# EAGLE design StaticPlatformMain_v1 (EAGLE 9.6.2)
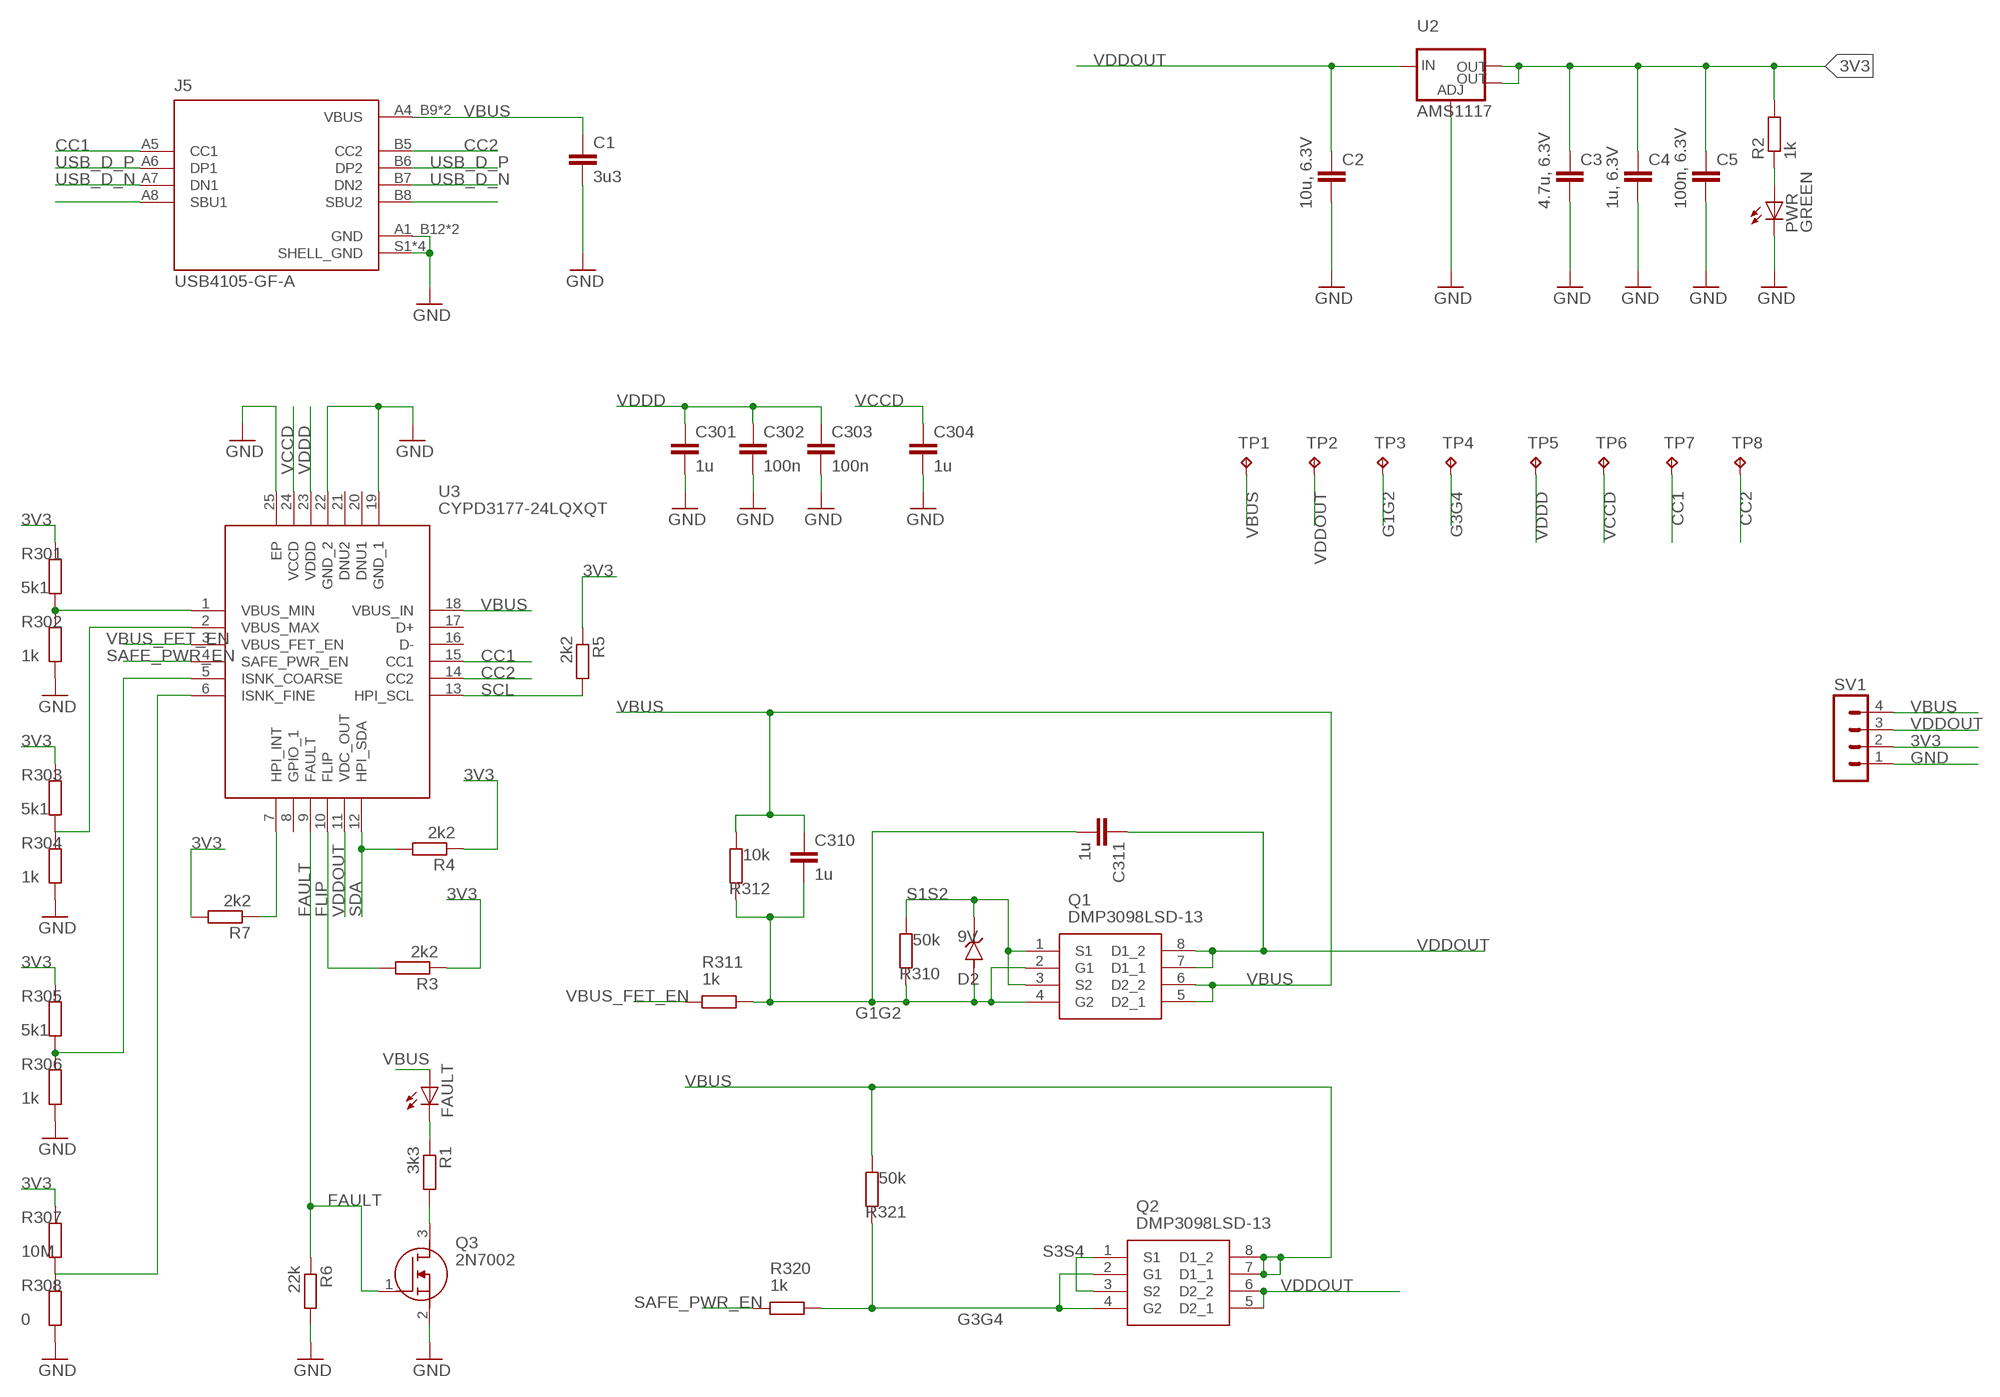
[diagram p0: schematic, sheet 1, part 1 of 2]
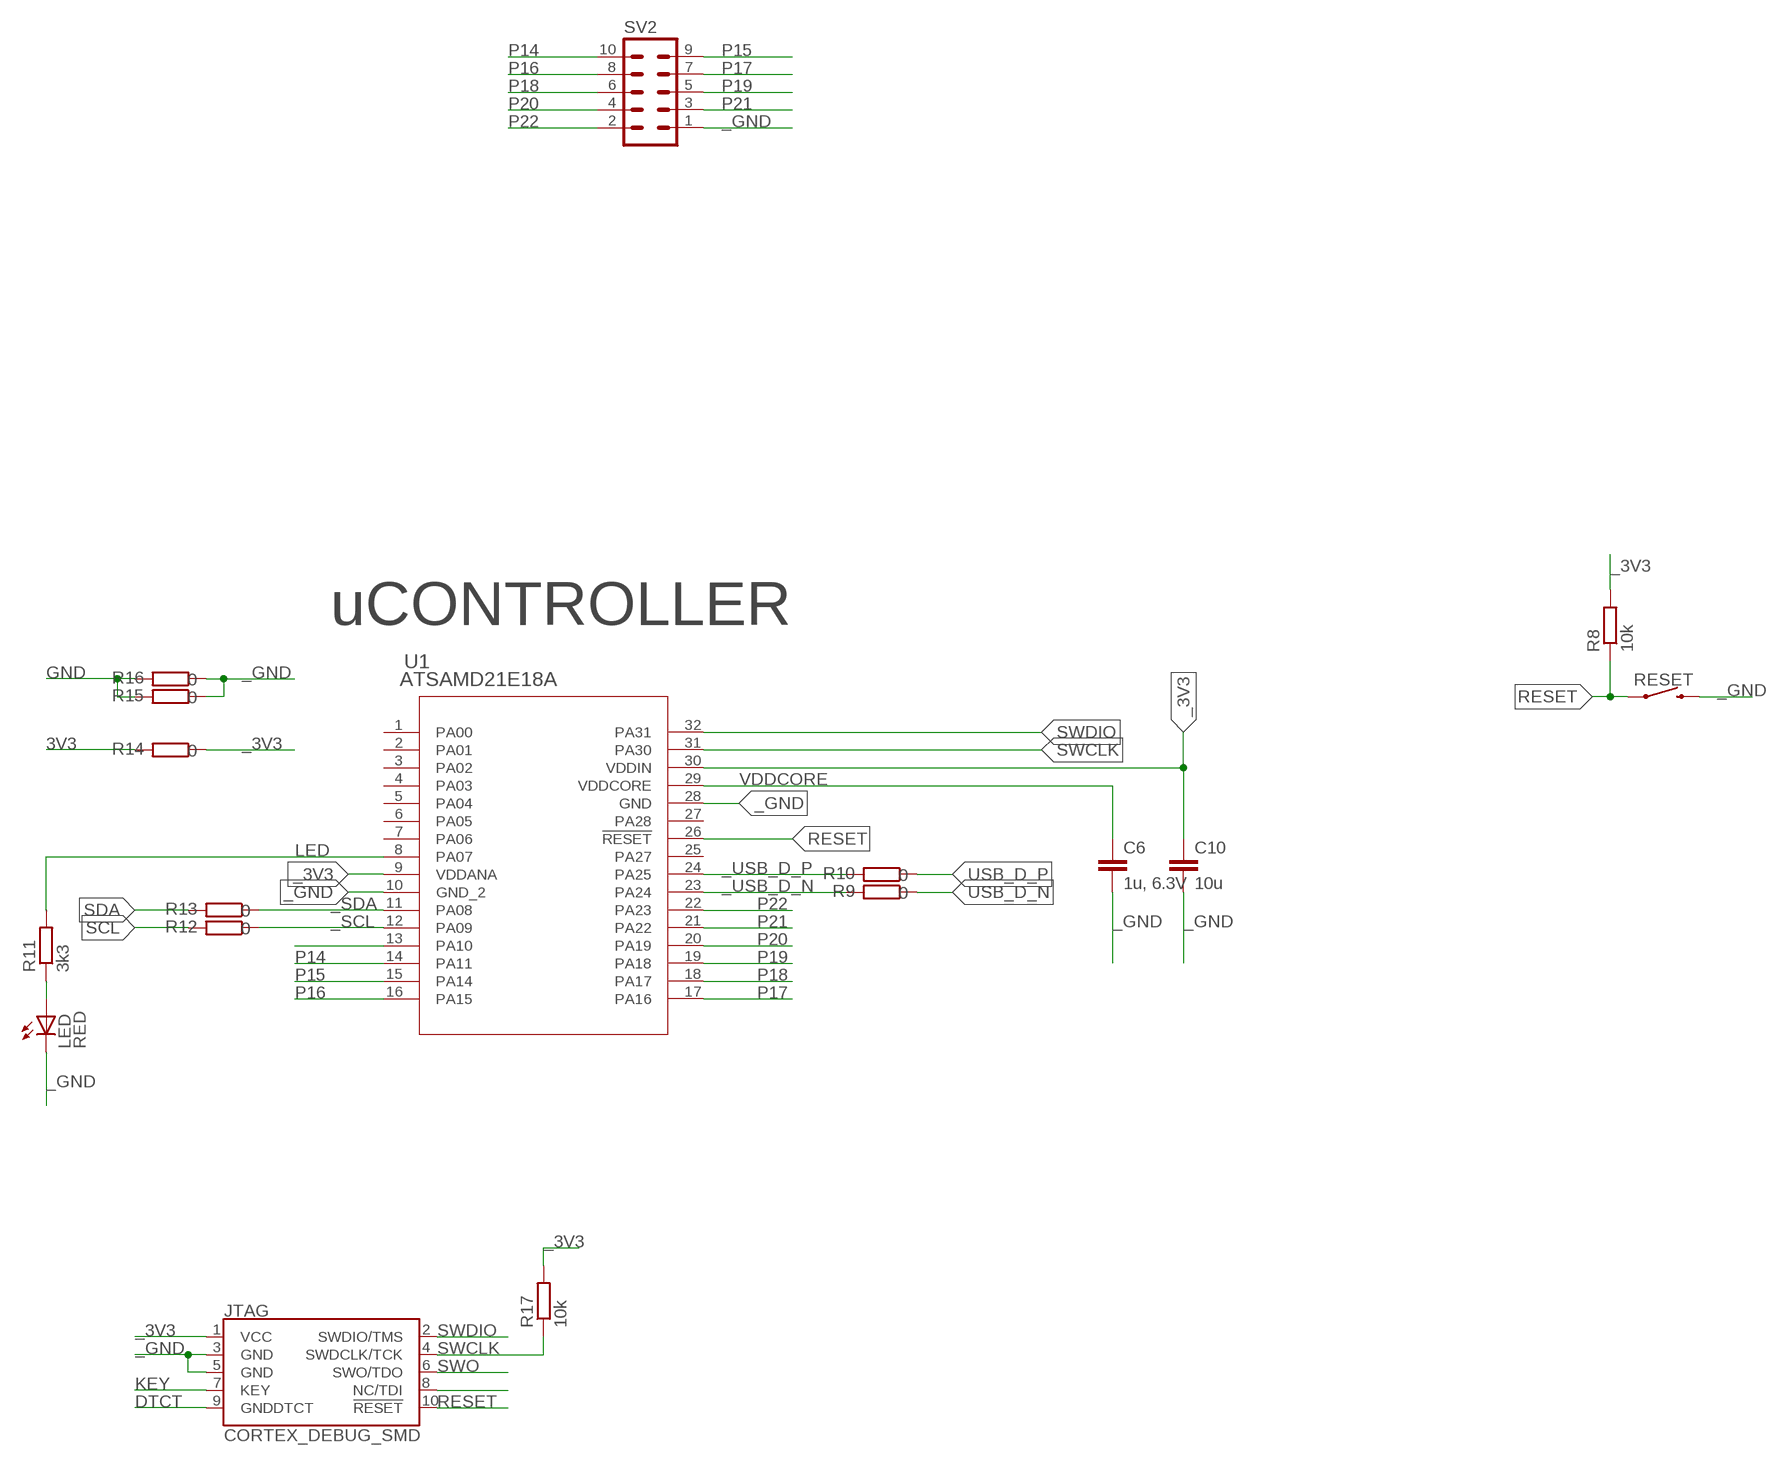
[diagram p1: schematic, sheet 1, part 2 of 2]

## Parts
C1  3u3  C-EUC0805K  [C0805K]
C2  10u, 6.3V  C-EUC0805K  [C0805K]
C3  4.7u, 6.3V  C-EUC0805K  [C0805K]
C4  1u, 6.3V  C-EUC0805K  [C0805K]
C5  100n, 6.3V  C-EUC0805K  [C0805K]
C6  1u, 6.3V  C-EUC0805  [C0805]
C10  10u  C-EUC0805  [C0805]
C301  1u  C-EUC0805K  [C0805K]
C302  100n  C-EUC0805K  [C0805K]
C303  100n  C-EUC0805K  [C0805K]
C304  1u  C-EUC0805K  [C0805K]
C310  1u  C-EUC0805K  [C0805K]
C311  1u  C-EUC0805K  [C0805K]
D2  9V  BZV55C12_L0G  [DIOMELF3515N]
FAULT  GREEN  LEDCHIPLED_0805  [CHIPLED_0805]
J5  USB4105-GF-A  [GCT_USB4105-GF-A]
JTAG  CORTEX_DEBUG_SMD  [SAMTECH_FTSH-105-01]
LED  RED  LEDCHIPLED_0805  [CHIPLED_0805]
PWR  GREEN  LEDCHIPLED_0805  [CHIPLED_0805]
Q1  DMP3098LSD-13  [SOIC127P600X175-8N]
Q2  DMP3098LSD-13  [SOIC127P600X175-8N]
Q3  2N7002  [SOT96P240X120-3N]
R1  3k3  R-EU_R0805  [R0805]
R2  1k  R-EU_R0805  [R0805]
R3  2k2  R-EU_R0805  [R0805]
R4  2k2  R-EU_R0805  [R0805]
R5  2k2  R-EU_R0805  [R0805]
R6  22k  R-EU_R0805  [R0805]
R7  2k2  R-EU_R0805  [R0805]
R8  10k  R-EU_R0805  [R0805]
R9  0  R-EU_R0805  [R0805]
R10  0  R-EU_R0805  [R0805]
R11  3k3  R-EU_R0805  [R0805]
R12  0  R-EU_R0805  [R0805]
R13  0  R-EU_R0805  [R0805]
R14  0  R-EU_R0805  [R0805]
R15  0  R-EU_R0805  [R0805]
R16  0  R-EU_R0805  [R0805]
R17  10k  R-EU_R0805  [R0805]
R301  5k1  R-EU_R0805  [R0805]
R302  1k  R-EU_R0805  [R0805]
R303  5k1  R-EU_R0805  [R0805]
R304  1k  R-EU_R0805  [R0805]
R305  5k1  R-EU_R0805  [R0805]
R306  1k  R-EU_R0805  [R0805]
R307  10M  R-EU_R0805  [R0805]
R308  0  R-EU_R0805  [R0805]
R310  50k  R-EU_R0805  [R0805]
R311  1k  R-EU_R0805  [R0805]
R312  10k  R-EU_R0805  [R0805]
R320  1k  R-EU_R0805  [R0805]
R321  50k  R-EU_R0805  [R0805]
RESET  MOMENTARY-SWITCH-SPST-SMD-6.0X3.5MM  [TACTILE_SWITCH_SMD_6.0X3.5MM]
SV1  MA04-1  [MA04-1]
SV2  MA05-2  [MA05-2]
TP1  TPTP18R  [TP18R]
TP2  TPTP18R  [TP18R]
TP3  TPTP18R  [TP18R]
TP4  TPTP18R  [TP18R]
TP5  TPTP18R  [TP18R]
TP6  TPTP18R  [TP18R]
TP7  TPTP18R  [TP18R]
TP8  TPTP18R  [TP18R]
U1  ATSAMD21E18A  ATSAMD21E18A-AUTQFP32_MC_MCH-M  [TQFP32_MC_MCH-M]
U2  AMS1117  V_REG_LM1117SOT223  [SOT223]
U3  CYPD3177-24LQXQT  [QFN50P400X400X60-25N]

## Nets
3V3: C3.1 C4.1 C5.1 R2.2 R3.1 R4.1 R5.1 R7.2 R14.2 R301.2 R303.2 R305.2 R307.2 SV1.2 U2.2(OUT) U2.4(OUT)
_3V3: C10.1 JTAG.1(VCC) R8.2 R14.1 R17.2 U1.9(VDDANA) U1.30(VDDIN)
_GND: C6.2 C10.2 JTAG.3(GND) JTAG.5(GND) LED.C R15.1 R16.1 RESET.2 SV2.1 U1.10(GND_2) U1.28(GND)
_SCL: R12.1 U1.12(PA09)
_SDA: R13.1 U1.11(PA08)
_USB_D_N [usbpair]: R9.2 U1.23(PA24)
_USB_D_P [usbpair]: R10.2 U1.24(PA25)
CC1: J5.A5(CC1) TP7.TP U3.15(CC1)
CC2: J5.B5(CC2) TP8.TP U3.14(CC2)
DTCT: JTAG.9(GNDDTCT)
FAULT: Q3.1(G) R6.1 U3.9(FAULT)
FLIP: R3.2 U3.10(FLIP)
G1G2: C310.2 C311.2 D2.A Q1.2(G1) Q1.4(G2) R310.2 R311.1 R312.2 TP3.TP
G3G4: Q2.2(G1) Q2.4(G2) R320.1 R321.2 TP4.TP
GND: C1.2 C2.2 C3.2 C4.2 C5.2 C301.2 C302.2 C303.2 C304.2 J5.A1_B12(GND) J5.B1_A12(GND) J5.S1(SHELL_GND) J5.S2(SHELL_GND) J5.S3(SHELL_GND) J5.S4(SHELL_GND) PWR.C Q3.2(S) R6.2 R15.2 R16.2 R302.1 R304.1 R306.1 R308.1 SV1.1 U2.1(ADJ) U3.19(GND_1) U3.22(GND_2) U3.25(EP)
KEY: JTAG.7(KEY)
LED: R11.2 U1.8(PA07)
LED_GP: LED.A R11.1
LED_PWR: PWR.A R2.1
N$1: FAULT.C R1.1
N$2: R7.1 U3.7(HPI_INT)
N$3: R301.1 R302.2 U3.1(VBUS_MIN)
N$4: R303.1 R304.2 U3.2(VBUS_MAX)
N$5: R305.1 R306.2 U3.5(ISNK_COARSE)
N$7: Q3.3(D) R1.2
N$9: J5.A8(SBU1)
N$10: R307.1 R308.2 U3.6(ISNK_FINE)
N$19: J5.B8(SBU2)
N$24: JTAG.8(NC/TDI)
N$28: U1.13(PA10)
P14: SV2.10 U1.14(PA11)
P15: SV2.9 U1.15(PA14)
P16: SV2.8 U1.16(PA15)
P17: SV2.7 U1.17(PA16)
P18: SV2.6 U1.18(PA17)
P19: SV2.5 U1.19(PA18)
P20: SV2.4 U1.20(PA19)
P21: SV2.3 U1.21(PA22)
P22: SV2.2 U1.22(PA23)
RESET: JTAG.10(!RESET) R8.1 RESET.1 U1.26(!RESET)
S1S2: D2.C(K) Q1.1(S1) Q1.3(S2) R310.1
S3S4: Q2.1(S1) Q2.3(S2)
SAFE_PWR_EN: R320.2 U3.4(SAFE_PWR_EN)
SCL: R5.2 R12.2 U3.13(HPI_SCL)
SDA: R4.2 R13.2 U3.12(HPI_SDA)
SWCLK: JTAG.4(SWDCLK/TCK) R17.1 U1.31(PA30)
SWDIO: JTAG.2(SWDIO/TMS) U1.32(PA31)
SWO: JTAG.6(SWO/TDO)
USB_D_N [usbpair]: J5.A7(DN1) J5.B7(DN2) R9.1
USB_D_P [usbpair]: J5.A6(DP1) J5.B6(DP2) R10.1
VBUS: C1.1 C310.1 FAULT.A J5.A4_B9(VBUS) J5.B4_A9(VBUS) Q1.5(D2_1) Q1.6(D2_2) Q2.7(D1_1) Q2.8(D1_2) R312.1 R321.1 SV1.4 TP1.TP U3.18(VBUS_IN)
VBUS_FET_EN: R311.2 U3.3(VBUS_FET_EN)
VCCD: C304.1 TP6.TP U3.24(VCCD)
VDDCORE: C6.1 U1.29(VDDCORE)
VDDD: C301.1 C302.1 C303.1 TP5.TP U3.23(VDDD)
VDDOUT: C2.1 C311.1 Q1.7(D1_1) Q1.8(D1_2) Q2.5(D2_1) Q2.6(D2_2) SV1.3 TP2.TP U2.3(IN) U3.11(VDC_OUT)
Unconnected: U1.1(PA00) U1.2(PA01) U1.3(PA02) U1.4(PA03) U1.5(PA04) U1.6(PA05) U1.7(PA06) U1.25(PA27) U1.27(PA28) U3.8(GPIO_1) U3.16(D-) U3.17(D+) U3.20(DNU1) U3.21(DNU2)

## Notes on the sheet
- uCONTROLLER

## Library data of the parts
C1-C6 C10 C301-C304 C310 C311 = rcl:C-EU: CAPACITOR, European symbol; SPICEPREFIX: C
D2 = BZV55C12_L0G:BZV55C12_L0G: Check availability <https://pricing.snapeda.com/parts/BZV55C12%20L0G/Taiwan%20Semiconductor%20Corporation/view-part?ref=eda>; AVAILABILITY: In Stock; CHECK_PRICES: https://www.snapeda.com/parts/BZV55C12%20L0G/Taiwan+Semiconductor/view-part/?ref=eda; DESCRIPTION: MMELF, 500mW, 5%, Small Signal Zener Diode; MF: Taiwan Semiconductor Corporation; MP: BZV55C12 L0G; PACKAGE: MINI MELF-2-2 Taiwan Semiconductor; PRICE: None; PURCHASE-URL: https://www.snapeda.com/api/url_track_click_mouser/?unipart_id=6304637&manufacturer=Taiwan Semiconductor Corporation&part_name=BZV55C12 L0G&search_term=None; SNAPEDA_LINK: https://www.snapeda.com/parts/BZV55C12%20L0G/Taiwan+Semiconductor/view-part/?ref=snap
FAULT LED PWR = adafruit:LED: LED OSRAM: - CHIPLED LG R971, LG N971, LY N971, LG Q971, LY Q971, LO R971, LY R971 LH N974, LH R974 LS Q976, LO Q976, LY Q976 LO Q996 - Hyper CHIPLED LW Q18S LB Q993, LB Q99A, LB R99A - SideLED LS A670, LO A670, LY A670, LG A670, LP A670 LB A673, LV A673, LT A673, LW A673 LH A674 LY A675 LS A676, LA A676, LO A676, LY A676, LW A676 LS A679, LY A679, LG A679 - Hyper Micro SIDELED® LS Y876, LA Y876, LO Y876, LY Y876 LT Y87S - SmartLED LW L88C, LW L88S LB L89C, LB L89S, LG L890 LS L89K, LO L89K, LY L89K LS L896, LA L896, LO L896, LY L896 - TOPLED LS T670, LO T670, LY T670, LG T670, LP T670 LSG T670, LSP T670, LSY T670, LOP T670, LYG T670 LG T671, LOG T671, LSG T671 LB T673, LV T673, LT T673, LW T673 LH T674 LS T676, LA T676, LO T676, LY T676, LB T676, LH T676, LSB T676, LW T676 LB T67C, LV T67C, LT T67C, LS T67K, LO T67K, LY T67K, LW E67C LS E67B, LA E67B, LO E67B, LY E67B, LB E67C, LV E67C, LT E67C LW T67C LS T679, LY T679, LG T679 LS T770, LO T770, LY T770, LG T770, LP T770 LB T773, LV T773, LT T773, LW T773 LH T774 LS E675, LA E675, LY E675, LS T675 LS T776, LA T776, LO T776, LY T776, LB T776 LHGB T686 LT T68C, LB T68C - Hyper Mini TOPLED® LB M676 - Mini TOPLED Santana® LG M470 LS M47K, LO M47K, LY M47K Source: http://www.osram.convergy.de/
J5 = USB4105-GF-A:USB4105-GF-A: USB-C (USB TYPE-C) USB 2.0 Receptacle Connector 24 (16+8 Dummy) Position Surface Mount, Right Angle; Through Hole Check availability <https://pricing.snapeda.com/parts/USB4105-GF-A/GCT/view-part?ref=eda>; AVAILABILITY: In Stock; DESCRIPTION: USB-C (USB TYPE-C) USB 2.0 Receptacle Connector 24 (16+8 Dummy) Position Surface Mount, Right Angle; Through Hole; MF: GCT; MP: USB4105-GF-A; PACKAGE: None; PRICE: None; PURCHASE-URL: https://pricing.snapeda.com/search?q=USB4105-GF-A&ref=eda
JTAG = SparkFun-Connectors:CORTEX_DEBUG: Cortex Debug Connector - 10 pin Supports JTAG debug, Serial Wire debug, and Serial Wire Viewer. PTH and SMD connector options available. General Connector Information <http://infocenter.arm.com/help/topic/com.arm.doc.faqs/attached/13634/cortex_debug_connectors.pdf> Products: PTH Connector <http://www.digikey.com/product-detail/en/cnc-tech/3220-10-0100-00/1175-1627-ND/3883661> -via Digi-Key SparkFun PSoc <https://www.sparkfun.com/products/13229> SparkFun T <https://www.sparkfun.com/products/13810>
Q1 Q2 = DMP3098LSD-13:DMP3098LSD-13: MOSFET PMOS-DUAL Source: Datasheet <https://www.diodes.com/assets/Datasheets/ds31448.pdf>; DESCRIPTION: MOSFET PMOS-DUAL; HEIGHT: 1.75mm; MANUFACTURER_NAME: Diodes Inc.; MANUFACTURER_PART_NUMBER: DMP3098LSD-13; MOUSER_PART_NUMBER: 621-DMP3098LSD-13; MOUSER_PRICE-STOCK: https://www.mouser.co.uk/ProductDetail/Diodes-Incorporated/DMP3098LSD-13?qs=oUsD4qhOtFxafARAi3NzqQ%3D%3D
Q3 = 2N7002:2N7002: N-channel MOSFET,2N7002 0.115A 60V Source: Datasheet <https://www.onsemi.com/pub/Collateral/NDS7002A-D.PDF>; DESCRIPTION: N-channel MOSFET,2N7002 0.115A 60V; HEIGHT: 1.2mm; MANUFACTURER_NAME: onsemi; MANUFACTURER_PART_NUMBER: 2N7002; MOUSER_PART_NUMBER: 512-2N7002; MOUSER_PRICE-STOCK: https://www.mouser.co.uk/ProductDetail/onsemi-Fairchild/2N7002?qs=0dwsXDNhqlz66WJJhrTFjQ%3D%3D
R1-R17 R301-R308 R310-R312 R320 R321 = rcl:R-EU_: RESISTOR, European symbol; SPICEPREFIX: R
RESET = SparkFun-Switches:MOMENTARY-SWITCH-SPST: Momentary Switch (Pushbutton) - SPST Normally-open (NO) SPST momentary switches (buttons, pushbuttons). Variants PTH-12MM - 12mm square, through-hole Momentary Pushbutton Switch - 12mm Square <https://www.sparkfun.com/products/9190> (COM-09190) PTH-6.0MM, PTH-6.0MM-KIT - 6.0mm square, through-hole Mini Pushbutton Switch <https://www.sparkfun.com/products/97> (COM-00097) KIT package intended for soldering kit's - only one side of pads' copper is exposed. PTH-RIGHT-ANGLE-KIT - Right-angle, through-hole Right Angle Tactile Button <https://www.sparkfun.com/products/10791> - Used on SparkFun BigTime Watch Kit <https://www.sparkfun.com/products/11734> SMD-12MM - 12mm square, surface-mount Tactile Button - SMD (12mm) <https://www.sparkfun.com/products/12993> (COM-12993) Used on SparkFun PicoBoard <https://www.sparkfun.com/products/11888> SMD-4.5MM - 4.5mm Square Trackball Switch Used on SparkFun Blackberry Trackballer Breakout <https://www.sparkfun.com/products/13169> SMD-4.6MMX2.8MM - 4.60mm x 2.80mm, surface mount Used on SparkFun Pro Micro - RP2040 <https://www.sparkfun.com/products/17717> SMD-5.2MM, SMD-5.2-REDUNDANT - 5.2mm square, surface-mount Mini Pushbutton Switch - SMD <https://www.sparkfun.com/products/8720> (COM-08720) Used on Arduino Pro Mini <https://www.sparkfun.com/products/11114> REDUNDANT package connects both switch circuits together SMD-6.0X3.5MM - 6.0 x 3.5mm, surface mount Momentary Reset Switch SMD <https://www.sparkfun.com/products/8229> (COM-08229) SMD-6.2MM-TALL - 6.2mm square, surface mount Tactile Button - SMD (6mm) <https://www.sparkfun.com/products/12992> Used on SparkFun Digital Sandbox <https://www.sparkfun.com/products/12651> SMD-RIGHT-ANGLE - Right-angle, surface mount Used on SparkFun Block for Intel® Edison - Arduino <https://www.sparkfun.com/products/13036>; PROD_ID: SWCH-14278; SF_SKU: COM-08229
SV1 = con-lstb_round_pads:MA04-1: PIN HEADER; OC_FARNELL: unknown; OC_NEWARK: unknown
SV2 = con-lstb_round_pads:MA05-2: PIN HEADER; OC_FARNELL: unknown; OC_NEWARK: unknown
TP1-TP8 = testpad:TP: Test pad
U1 = SAMD21E18:ATSAMD21E18A-AU; COPYRIGHT: Copyright (C) 2022 Ultra Librarian. All rights reserved.; MANUFACTURER_PART_NUMBER: ATSAMD21E18A-AU; MFR_NAME: Microchip
U2 = SparkFun-IC-Power:V_REG_LM1117: Voltage Regulator LM1117 Standard adjustable voltage regulator but in SMD form. Spark Fun Electronics SKU : COM-00595; PROD_ID: VREG-08170
U3 = CYPD3177-24LQXQT:CYPD3177-24LQXQT: USB Type-C DFP Port Controller USB 1.1 3.3V/5V T/R 24-Pin QFN EP Source: Datasheet <https://www.cypress.com/file/460416/download>; DESCRIPTION: USB Type-C DFP Port Controller USB 1.1 3.3V/5V T/R 24-Pin QFN EP; HEIGHT: 0.6mm; MANUFACTURER_NAME: Cypress Semiconductor; MANUFACTURER_PART_NUMBER: CYPD3177-24LQXQT; MOUSER_PART_NUMBER: 727-CYPD3177-24LQXQT; MOUSER_PRICE-STOCK: https://www.mouser.co.uk/ProductDetail/Cypress-Semiconductor/CYPD3177-24LQXQT?qs=PzGy0jfpSMvUfBLYWBYBLA%3D%3D

## Net classes
1 usbpair: width 0.25 mm, clearance 0.2 mm

## Board
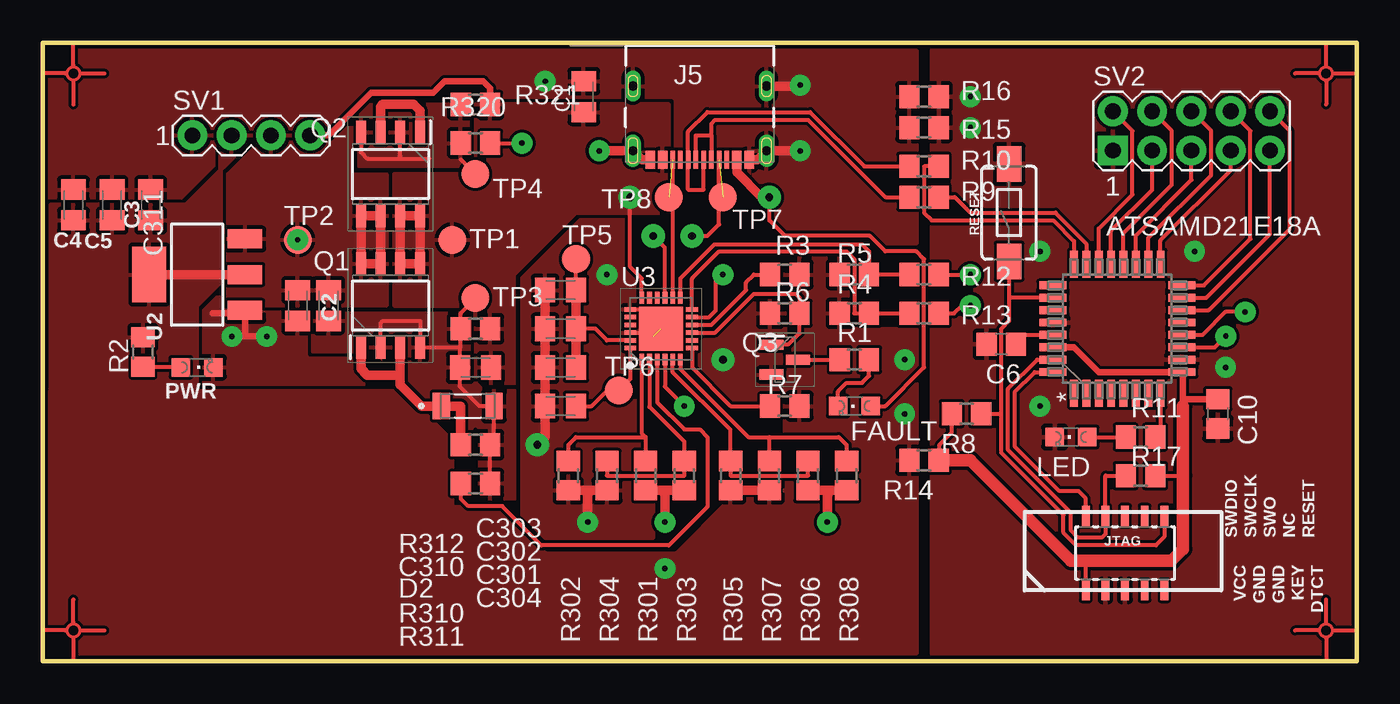
[diagram p2: board, top side]
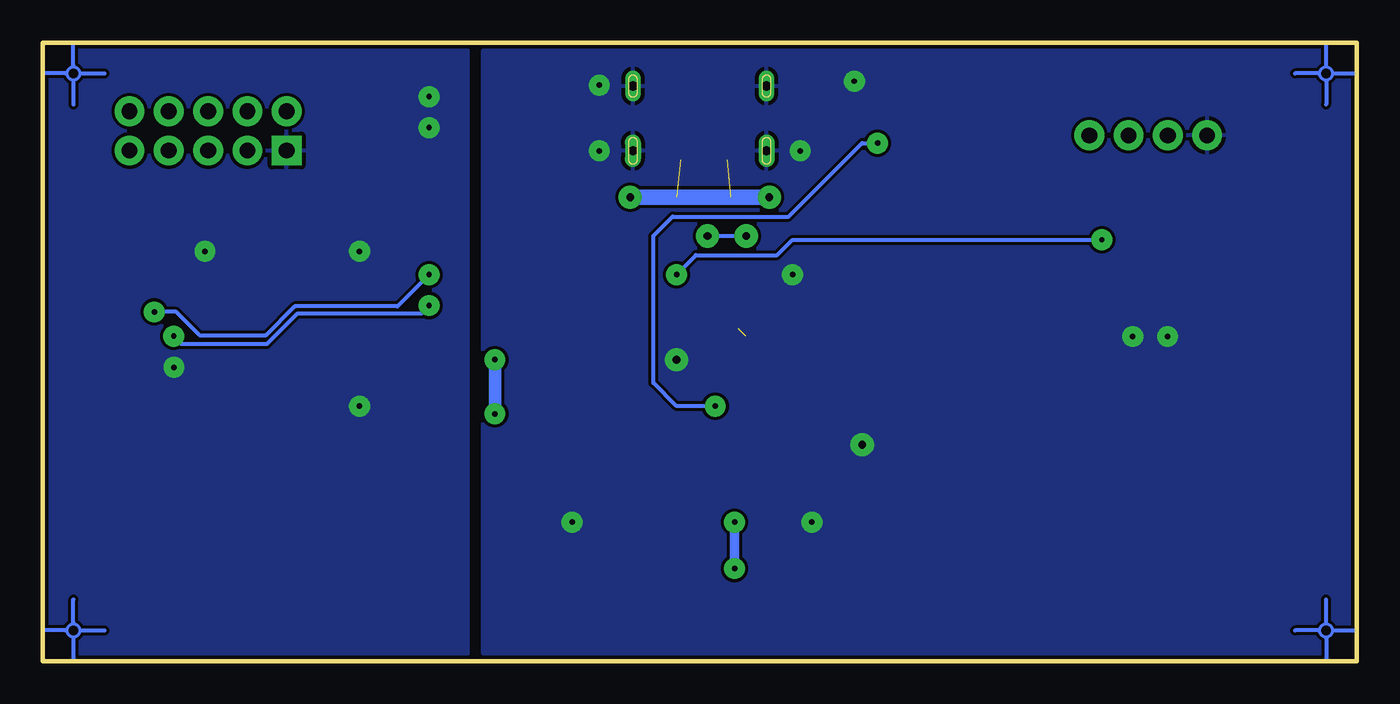
[diagram p3: board, bottom side, seen from below]

Size 85 x 40 mm. Coordinates in mm from the lower left corner, seen from the top.
Outline: 0,40 85,40 85,0 0,0 0,40
Copper layers (1*16): Top 0.035mm / dielectric 1.5mm / Bottom 0.035mm
Design rules "default *": minimum track width 0.25mm, minimum drill 0.35mm, track to track 0.2mm, track to pad 0.2mm, pad to pad 0.2mm, via to via 0.2mm, smd to smd 0.2mm, copper to edge 0.2mm, drill to drill 0.2mm, minimum pad ring 8mil, minimum via ring 0.5mm, stop-mask expansion 4mil, vias tented up to drill 0mil, thermal gap 10mil
tRestrict: 2 lines

### Footprints (pad centres in the part's own frame; a part is rotated, then mirrored left to right if it is on the bottom)
C0805K = smd 1.3 x 1.6: 1 -1,0; 2 1,0
C0805 = smd 1.3 x 1.5: 1 -0.95,0; 2 0.95,0
DIOMELF3515N = smd 1.11 x 1.73: A 1.705,0; C -1.705,0
CHIPLED_0805 = smd 1.2 x 1.2: A 0,-1.05; C 0,1.05
GCT_USB4105-GF-A = smd 0.6 x 1.15: A1_B12 -3.2,4.755; A4_B9 -2.4,4.755; B1_A12 3.2,4.755; B4_A9 2.4,4.755 | smd 0.3 x 1.15: A5 -1.25,4.755; A6 -0.25,4.755; A7 0.25,4.755; A8 1.25,4.755; B5 1.75,4.755; B6 0.75,4.755; B7 -0.75,4.755; B8 -1.75,4.755 | drill 0.6 pad 1.05 long: S1 -4.32,4.18; S4 4.32,4.18 | drill 0.6 pad 1 long: S2 -4.32,0; S3 4.32,0
SAMTECH_FTSH-105-01 = smd 0.508 x 1.27: 1 -2.54,-2.413; 2 -2.54,2.413; 3 -1.27,-2.413; 4 -1.27,2.413; 5 0,-2.413; 6 0,2.413; 7 1.27,-2.413; 8 1.27,2.413; 9 2.54,-2.413; 10 2.54,2.413
SOIC127P600X175-8N = smd 1.5 x 0.65: 1 -2.7,1.905; 2 -2.7,0.635; 3 -2.7,-0.635; 4 -2.7,-1.905; 5 2.7,-1.905; 6 2.7,-0.635; 7 2.7,0.635; 8 2.7,1.905
SOT96P240X120-3N = smd 1.55 x 0.65: 1 -0.85,0.96; 2 -0.85,-0.96; 3 0.85,0
R0805 = smd 1.3 x 1.5: 1 -0.95,0; 2 0.95,0
TACTILE_SWITCH_SMD_6.0X3.5MM = smd 2.3 x 1.6: 1 -3.15,0; 2 3.15,0
MA04-1 = drill 1.016 pad 1.93: 1 -3.81,0; 2 -1.27,0; 3 1.27,0; 4 3.81,0
MA05-2 = drill 1.016 pad 1.93 square: 1 -5.08,-1.27 | drill 1.016 pad 1.93: 2 -5.08,1.27; 3 -2.54,-1.27; 4 -2.54,1.27; 5 0,-1.27; 6 0,1.27; 7 2.54,-1.27; 8 2.54,1.27; 9 5.08,-1.27; 10 5.08,1.27
TP18R = smd 1.8 x 1.8: TP 0,0
TQFP32_MC_MCH-M = smd 1.762 x 0.507: 1 -4.169,2.8; 2 -4.169,2; 3 -4.169,1.2; 4 -4.169,0.4; 5 -4.169,-0.4; 6 -4.169,-1.2; 7 -4.169,-2; 8 -4.169,-2.8; 17 4.169,-2.8; 18 4.169,-2; 19 4.169,-1.2; 20 4.169,-0.4; 21 4.169,0.4; 22 4.169,1.2; 23 4.169,2; 24 4.169,2.8 | smd 0.507 x 1.762: 9 -2.8,-4.169; 10 -2,-4.169; 11 -1.2,-4.169; 12 -0.4,-4.169; 13 0.4,-4.169; 14 1.2,-4.169; 15 2,-4.169; 16 2.8,-4.169; 25 2.8,4.169; 26 2,4.169; 27 1.2,4.169; 28 0.4,4.169; 29 -0.4,4.169; 30 -1.2,4.169; 31 -2,4.169; 32 -2.8,4.169
SOT223 = smd 1.219 x 2.235: 1 -2.311,-3.099; 2 0,-3.099; 3 2.311,-3.099 | smd 3.6 x 2.2: 4 0,3.099
QFN50P400X400X60-25N = smd 0.75 x 0.3: 1 -2,1.25; 2 -2,0.75; 3 -2,0.25; 4 -2,-0.25; 5 -2,-0.75; 6 -2,-1.25; 13 2,-1.25; 14 2,-0.75; 15 2,-0.25; 16 2,0.25; 17 2,0.75; 18 2,1.25 | smd 0.3 x 0.75: 7 -1.25,-2; 8 -0.75,-2; 9 -0.25,-2; 10 0.25,-2; 11 0.75,-2; 12 1.25,-2; 19 1.25,2; 20 0.75,2; 21 0.25,2; 22 -0.25,2; 23 -0.75,2; 24 -1.25,2 | smd 2.85 x 2.85: 25 0,0

### Placement (x,y rotation side)
C1  35,36.5 90 top
C2  16.5,23 270 top
C3  7,29.5 90 top
C4  2,29.5 90 top
C5  4.5,29.5 90 top
C6  62,20.5 180 top
C10  76,16 270 top
C301  33.5,19 180 top
C302  33.5,21.5 180 top
C303  33.5,24 180 top
C304  33.5,16.5 180 top
C310  28,19 180 top
C311  18.5,23 270 top
D2  27.5,16.5 0 top
FAULT  52.5,16.5 90 top
J5  42.5,37.18 180 top
JTAG  70,7 0 top
LED  66.5,14.5 90 top
PWR  10,19 270 top
Q1  22.5,23 90 top
Q2  22.5,31.5 270 top
Q3  48,19.5 0 top
R1  52.5,19.5 180 top
R2  6.5,20 90 top
R3  48,25 180 top
R4  52.5,22.5 0 top
R5  52.5,25 0 top
R6  48,22.5 180 top
R7  48,16.5 0 top
R8  59.75,16 180 top
R9  57,30 0 top
R10  57,32 0 top
R11  71,14.5 0 top
R12  57,25 180 top
R13  57,22.5 180 top
R14  57,13 180 top
R15  57,34.5 180 top
R16  57,36.5 180 top
R17  71,12 0 top
R301  39,12 270 top
R302  34,12 90 top
R303  41.5,12 270 top
R304  36.5,12 90 top
R305  44.5,12 270 top
R306  49.5,12 90 top
R307  47,12 270 top
R308  52,12 90 top
R310  28,14 0 top
R311  28,11.5 180 top
R312  28,21.5 180 top
R320  28,33.5 0 top
R321  28,36 180 top
RESET  62.5,29 90 top
SV1  13.5,34 0 top
SV2  74.3,34.29 0 top
TP1  26.5,27.25 0 top
TP2  16.5,27.25 0 top
TP3  28,23.5 0 top
TP4  28,31.5 0 top
TP5  34.5,26 0 top
TP6  37.25,17.5 0 top
TP7  44,30 0 top
TP8  40.5,30 0 top
U1  69.5,21.5 90 top
U2  10,25 90 top
U3  40,21.5 90 top

### Tracks (layer width: path | path; a pad name or v marks a point on that pad's centre or on a via)
3V3  (via drill 0.35)
  Top 0.61: R301.2 40,11.05 | 40,11.05 R303.2 | 40,11.05 40.25,10.8 v40.25,9 | R305.2 46,11.05 R307.2 | U2.2 U2.4
  Bottom 0.61: v40.25,9 v40.25,6
  Bottom 0.813: v55.75,16 v55.75,19.5
  pour Top (rank 2): 11.5,34.5 11.5,31.75 9.25,29.5 0.5,29.5 0.5,14 10,14 10,23 14.5,27.5 14.5,34.5
  pour Top (rank 2): 0.5,17.5 23.25,17.5 26.5,14.25 26.5,10 29.5,10 32.5,7 41,7 44.5,10.5 48,10.5 48,21.5 56.5,21.5 56.5,0.5 0.5,0.5
  pour Top (rank 2): 48,27 48,21 52.5,21 52.5,27
_3V3
  Top 0.25: 73.75,18.62 U1.9 | R17.2 73.75,12 | R14.1 58,13.05 58,14 58.8,14.8 R8.2 | JTAG.1 67.46,6.46 67.5,6.5
  Top 0.406: U1.9 68.3,18.7 66.7,20.3 U1.30 | 73.75,16.5 73.75,17 | 73.75,17 73.75,18.62 | C10.1 73.8,16.95 73.75,17
  Top 0.813: R14.1 60,13 66.5,6.5 67.5,6.5 73,6.5 73.75,7.25 73.75,12 73.75,16.5
_GND  (via drill 0.35)
  other vias: 60,36.5 60,34.5 64.5,26.5 64.5,16.5 76.5,19 74.5,26.5
  pour Top (rank 4): 57.5,39.5 57.5,0.5 84.5,0.5 84.5,39.5
  pour Bottom (rank 4): 57.5,39.5 57.5,0.5 84.5,0.5 84.5,39.5
_SCL  (via drill 0.35)
  Top 0.25: R12.1 v60,25 | v77.77,22.58 76.5,22.58 75.02,21.1 U1.12
  Bottom 0.25: v60,25 62.05,22.95 68.69,22.95 70.55,21.08 74.84,21.08 76.34,22.58 v77.77,22.58
_SDA  (via drill 0.35)
  Top 0.25: v60,23 59.45,23 58.95,22.5 R13.1 | U1.11 75.8,20.3 v76.52,21.02
  Bottom 0.25: v60,23 60.5,22.5 68.5,22.5 70.48,20.52 76.02,20.52 v76.52,21.02
_USB_D_N
  Top 0.25: R9.2 59,30 60,29 65.5,29 67.5,27 U1.23
_USB_D_P
  Top 0.25: R10.2 57.02,32 57,31.98 57,29 57.5,28.5 65.36,28.5 66.7,27.16 U1.24
CC1  (via drill 0.5)  (1 unrouted)
  Top 0.25: U3.15 40.25,26.75 v39.5,27.5 | v42,27.5 43,27.5 43.75,28.25 J5.A5
  Bottom 0.25: v42,27.5 v39.5,27.5
CC2  (1 unrouted)
  Top 0.25: J5.B5 U3.14
FAULT
  Top 0.25: U3.9 43.5,21.25 46,23.75 48.7,23.75 48.95,23.5 R6.1 48.95,21.2 48.25,20.5 47.19,20.5 Q3.1
FLIP
  Top 0.25: U3.10 43.25,21.75 45.5,24 45.5,24.5 46,25 R3.2
G1G2
  Top 0.25: Q1.2 21.86,21.86 22,22 24.41,22 Q1.4 26.95,20.3 27,20.25 | R311.1 R310.2 29.2,14.26 D2.A 28.25,16.5 27,17.75 C310.2 27,20.25 | 27,20.25 27,21.45 R312.2 27.05,22.5 28,23.45 TP3.TP
  pour Top (rank 2): 30.5,17.5 30.5,10.5 28,10.5 28,13.5 21.5,20 17.5,20 17.5,22.5 28,22.5 28,18 28.5,17.5
G3G4
  Top 0.25: Q2.4 20.59,32.91 21,32.5 23,32.5 | 23,32.5 23.14,32.63 Q2.2 | 23,32.5 25,32.5 | TP4.TP 27.05,32.45
  pour Top (rank 2): 27.5,36 27.5,32 20.5,32 20.5,36
GND  (via drill 0.35, 0.5)  (1 unrouted)
  Top 0.25: U3.22 39.25,21.25 39.5,21 | U3.19 38.75,22.75 39,22.5
  Top 0.406: v12.25,21 13,21 | 13,21 v14.5,21 | 13,21 13.1,21.1 U2.1 12.91,22.5 11,22.5
  Top 0.61: C303.2 C302.2 C301.2 C304.2 32.5,14.5 v32,14 | R302.1 35.5,11.05 | 35.5,11.05 R304.1 | 35.5,11.05 35.25,10.8 v35.25,9 | R306.1 51,11.05 | 51,11.05 R308.1 | 51,11.05 50.75,10.8 v50.75,9 | v36,33 J5.S4 38.76,32.43 J5.B1_A12 | v49,33 J5.S1 46.24,32.43 J5.A1_B12 | J5.S2 48.93,37.18 v49,37.25
  other vias: 44,19.5 36.5,25 32.5,37.5
  pour Top (rank 3): 39.5,28.5 34.5,28.5 31,25 31,9.5 32.5,8 39.5,8
  pour Top (rank 3): 48,16.5 44.5,16.5 42.5,18.5 42.5,20.5 46,24 48,24
  pour Top (rank 3): 56.5,27 0.5,27 0.5,39.5 56.5,39.5
  pour Top (rank 3): 10,23.5 10,17 21,17 21,19.5 17,23.5
  pour Bottom (rank 4): 0.5,39.5 0.5,0.5 56.5,0.5 56.5,39.5
LED
  Top 0.25: U1.8 72.3,14.85 R11.2
LED_GP
  Top 0.25: LED.A R11.1
LED_PWR
  Top 0.25: R2.1 8.9,19.05 PWR.A
N$1
  Top 0.25: FAULT.C 51.45,17.45 52,18 53,18 53.45,18.45 R1.1
N$2
  Top 0.25: R7.1 44.5,16.5 42,19 U3.7
N$3
  Top 0.25: U3.1 38.75,14.75 39,14.5 | 39,14.5 R301.1 | R302.2 34,14 34.5,14.5 39,14.5
N$4
  Top 0.25: U3.2 39.25,16.45 41.5,14.2 R303.1 41.5,12 36.5,12 R304.2
N$5
  Top 0.25: U3.5 40.75,18.7 44.48,14.97 44.48,12.97 R305.1 44.5,12 49.5,12 R306.2
N$6
  Bottom 0.25: 2,38.5 2,40
N$7
  Top 0.25: Q3.3 R1.2
N$8
  Bottom 0.25: 2.5,38 4,38
N$10
  Top 0.25: U3.6 41.25,18.89 45.64,14.5 47,14.5 | 47,14.5 51.5,14.5 52,14 R308.2 | R307.1 47,14.5
N$11
  Bottom 0.25: 2,37.5 2,36
N$12
  Bottom 0.25: 1.5,38 0,38
N$13
  Bottom 0.25: 2,2.5 2,4
N$14
  Top 0.25: 2,38.5 2,40
N$15
  Top 0.25: 1.5,38 0,38
N$16
  Top 0.25: 2,37.5 2,36
N$17
  Top 0.25: 2.5,38 4,38
N$18
  Top 0.25: 83,38.5 83,40
N$20
  Top 0.25: 82.5,38 81,38
N$21
  Top 0.25: 83,37.5 83,36
N$22
  Top 0.25: 83.5,38 85,38
N$23
  Top 0.25: 83,2.5 83,4
N$25
  Bottom 0.25: 2.5,2 4,2
N$26
  Bottom 0.25: 2,1.5 2,0
N$27
  Bottom 0.25: 1.5,2 0,2
N$29
  Top 0.25: 82.5,2 81,2
N$30
  Top 0.25: 83,1.5 83,0
N$31
  Top 0.25: 83.5,2 85,2
N$32
  Top 0.25: 2,2.5 2,4
N$33
  Top 0.25: 1.5,2 0,2
N$34
  Top 0.25: 2,1.5 2,0
N$35
  Top 0.25: 2.5,2 4,2
N$36
  Bottom 0.25: 83,2.5 83,4
N$37
  Bottom 0.25: 83.5,2 85,2
N$38
  Bottom 0.25: 83,1.5 83,0
N$39
  Bottom 0.25: 82.5,2 81,2
N$44
  Bottom 0.25: 83,38.5 83,40
N$45
  Bottom 0.25: 83.5,38 85,38
N$46
  Bottom 0.25: 83,37.5 83,36
N$47
  Bottom 0.25: 82.5,38 81,38
P14
  Top 0.25: U1.14 75.41,22.7 80.64,27.94 80.64,34.29 SV2.10
P15
  Top 0.25: U1.15 75.25,23.5 79.38,27.62 SV2.9
P16
  Top 0.25: U1.16 75.1,24.3 78.11,27.3 78.11,34.29 SV2.8
P17
  Top 0.25: U1.17 72.3,27.21 76.83,31.75 SV2.7
P18
  Top 0.25: U1.18 71.5,27.37 75.56,31.43 75.56,34.29 SV2.6
P19
  Top 0.25: U1.19 70.7,27.52 74.3,31.11 SV2.5
P20
  Top 0.25: U1.20 69.9,27.67 73.03,30.8 73.03,34.29 SV2.4
P21
  Top 0.25: U1.21 69.1,27.82 71.75,30.48 SV2.3
P22
  Top 0.25: U1.22 68.3,27.98 70.48,30.16 70.48,34.29 SV2.2
RESET
  Top 0.25: U1.26 62.5,23.5 | 61.99,16 61.99,13.49 66.02,9.46 66.02,8.3 66.83,7.5 72,7.5 72.54,8.04 JTAG.10 | 61.99,16 61.99,21.49 62.5,22 62.5,23.5 | RESET.1 62.5,23.5 | R8.1 61.99,16
S1S2
  Top 0.61: Q1.1 20.59,18.91 21,18.5 23.14,18.5 Q1.3 23.14,17.86 24.5,16.5 D2.C 27.05,16.5 R310.1
S3S4
  Top 0.61: Q2.3 21.86,35.87 22,36 24,36 24.41,35.59 Q2.1
SAFE_PWR_EN  (via drill 0.35)
  Top 0.25: U3.4 40.25,17.75 v41.5,16.5 | R320.2 v31,33.5
  Bottom 0.25: v41.5,16.5 44,16.5 45.5,18 45.5,27.5 44.25,28.75 36.75,28.75 32,33.5 v31,33.5
SCL
  Top 0.25: U3.13 41.25,24.75 43.45,26.95 53,26.95 53.45,26.5 R5.2 R12.2
SDA
  Top 0.25: U3.12 42,24.75 43.75,26.5 52,26.5 52.5,26 52.5,22.5 R4.2 R13.2
SWCLK
  Top 0.25: U1.31 64.33,19.5 62.44,17.62 62.44,13.68 66.5,9.62 66.5,8.46 66.96,8 68.5,8 68.73,8.23 JTAG.4 68.73,12 R17.1
SWDIO
  Top 0.25: JTAG.2 67.46,10.54 67,11 65.76,11 62.89,13.87 62.89,17.43 64.16,18.7 U1.32
USB_D_N
  Top 0.25: J5.A7 42.25,34 43.25,34 | 43.25,34 J5.B7 | 43.25,34 43.25,34.75 43.5,35 49.5,35 54.5,30 R9.1
USB_D_P
  Top 0.25: R10.1 53.14,32 49.64,35.5 43,35.5 41.75,34.25 J5.B6 41.75,30.5 42.75,30.5 J5.A6
VBUS  (via drill 0.5)
  Top 0.25: U3.18 38.75,24.75 38,25.5 v38,30 | FAULT.A 54.5,16.5 57,19 57,26 56.5,26.5 54.5,26.5 53.5,27.5 48,27.5 47,28.5 v47,30
  Top 0.406: R321.1 28.95,37.05 28.5,37.5 26,37.5 25.25,36.75 21.25,36.75 18.5,34 SV1.4
  Top 0.61: J5.B4_A9 40.1,32.1 | J5.A4_B9 44.9,31.6 46.5,30 v47,30 | Q1.6 Q2.7 Q2.8 Q1.5 Q1.6
  Bottom 1.016: v38,30 v47,30
  pour Top: 22.75,31.5 22.75,23 28,23 28,18 30.5,18 30.5,25 34.5,29 40,29 40.5,29.5 40.5,36 28,36 28,31.5
VBUS_FET_EN
  Top 0.25: U3.3 39.75,16.75 41.5,15 42.5,15 43,14.5 43,10 40.5,7.5 32.25,7.5 29.73,10.03 27.52,10.03 27.05,10.5 R311.2
VCCD
  Top 0.25: C304.1 35.5,16.5 36.5,17.5 TP6.TP 38,18.25 U3.24
VDDCORE
  Top 0.25: C6.1 63.55,21.1 U1.29
VDDD
  Top 0.25: C302.1 35.75,21.5 36.5,20.75 U3.23 | C303.1 TP5.TP
  Top 0.61: C301.1 C302.1 C303.1
VDDOUT  (via drill 0.35)
  Top 0.25: U3.11 43.11,22.25 43.55,22.69 43.55,24.55 v44,25
  Top 0.61: Q1.8 Q2.5 Q2.6 Q1.7 Q1.8
  Bottom 0.25: v44,25 42.75,26.25 37.5,26.25 36.5,27.25 TP2.TP
  other vias: 16.5,27.25
  pour Top: 22.25,31.5 22.25,23 12,23 12,31.5 15,34.5 20,34.5 20,31.5
(copper drawn outside any net)
  shapes: Bottom circle x4, Top circle x4

### Text on the board
tNames: SWDIO | SWCLK | SWO | NC | RESET | VCC | GND | GND | KEY | DTCT